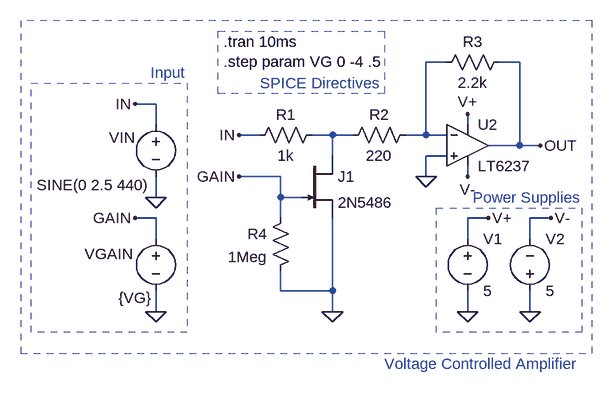
[diagram p0: schematic vca study.asc]
vca study.asc, the LTspice schematic file:
Version 4
SHEET 1 1572 680
WIRE 1168 -48 1136 -48
WIRE 1280 -48 1248 -48
WIRE 720 16 688 16
WIRE 720 48 720 16
WIRE 1200 48 1200 32
WIRE 880 64 848 64
WIRE 992 64 960 64
WIRE 1024 64 992 64
WIRE 1136 64 1136 -48
WIRE 1136 64 1104 64
WIRE 1168 64 1136 64
WIRE 1280 80 1280 -48
WIRE 1280 80 1232 80
WIRE 1312 80 1280 80
WIRE 992 96 992 64
WIRE 1168 96 1136 96
WIRE 912 128 848 128
WIRE 1136 128 1136 96
WIRE 1200 128 1200 112
WIRE 720 160 720 128
WIRE 912 160 912 128
WIRE 944 160 912 160
WIRE 720 192 688 192
WIRE 912 192 912 160
WIRE 1232 192 1200 192
WIRE 1328 192 1296 192
WIRE 720 224 720 192
WIRE 1200 224 1200 192
WIRE 1296 224 1296 192
WIRE 912 304 912 272
WIRE 992 304 992 192
WIRE 992 304 912 304
WIRE 720 336 720 304
WIRE 992 336 992 304
WIRE 1200 336 1200 304
WIRE 1296 336 1296 304
FLAG 1200 32 V+
FLAG 1200 128 V-
FLAG 992 336 0
FLAG 1232 192 V+
FLAG 1200 336 0
FLAG 1328 192 V-
FLAG 1296 336 0
FLAG 720 160 0
FLAG 688 16 IN
FLAG 688 192 GAIN
FLAG 720 336 0
FLAG 848 128 GAIN
FLAG 1136 128 0
FLAG 848 64 IN
FLAG 1312 80 OUT
SYMBOL res 1264 -64 R90
WINDOW 0 0 56 VBottom 2
WINDOW 3 32 56 VTop 2
SYMATTR InstName R3
SYMATTR Value 2.2k
SYMBOL res 1120 48 R90
WINDOW 0 0 56 VBottom 2
WINDOW 3 32 56 VTop 2
SYMATTR InstName R2
SYMATTR Value 220
SYMBOL res 928 176 M0
SYMATTR InstName R4
SYMATTR Value 1Meg
SYMBOL Opamps\\LT6237 1200 80 R0
SYMATTR InstName U2
SYMBOL res 976 48 R90
WINDOW 0 0 56 VBottom 2
WINDOW 3 32 56 VTop 2
SYMATTR InstName R1
SYMATTR Value 1k
SYMBOL njf 944 96 R0
SYMATTR InstName J1
SYMATTR Value 2N5486
SYMBOL voltage 1200 208 R0
WINDOW 123 0 0 Left 2
WINDOW 39 0 0 Left 2
SYMATTR InstName V1
SYMATTR Value 5
SYMBOL voltage 1296 320 M180
WINDOW 0 24 96 Left 2
WINDOW 3 24 16 Left 2
SYMATTR InstName V2
SYMATTR Value 5
SYMBOL voltage 720 32 M0
WINDOW 3 10 109 Left 2
WINDOW 123 0 0 Left 2
WINDOW 39 0 0 Left 2
WINDOW 0 32 36 Left 2
SYMATTR Value SINE(0 2.5 440)
SYMATTR InstName VIN
SYMBOL voltage 720 208 M0
WINDOW 3 6 107 Left 2
WINDOW 123 0 0 Left 2
WINDOW 39 0 0 Left 2
WINDOW 0 35 39 Left 2
SYMATTR Value {VG}
SYMATTR InstName VGAIN
TEXT 824 -80 Left 2 !.tran 10ms\n.step param VG 0 -4 .5
TEXT 1208 160 Left 2 ;Power Supplies
TEXT 712 -32 Left 2 ;Input
TEXT 880 -16 Left 2 ;SPICE Directives
TEXT 1072 416 Left 2 ;Voltage Controlled Amplifier
RECTANGLE Normal 1376 368 1152 176 2
RECTANGLE Normal 528 -16 768 368 2
RECTANGLE Normal 1072 0 816 -96 2
RECTANGLE Normal 1392 -112 512 400 2

The netlist it stands for:
* vca study.asc
R3 OUT N001 2.2k
R2 N001 N002 220
R4 GAIN 0 1Meg
* U2: LT6237 (symbol Opamps\LT6237 not available, pins judged from their places): In+=0 In-=N001 V+=V+ V-=V- OUT=OUT
R1 N002 IN 1k
J1 N002 GAIN 0 2N5486
V1 V+ 0 5
V2 0 V- 5
VIN IN 0 SINE(0 2.5 440)
VGAIN GAIN 0 {VG}
.model NJF NJF
.model PJF PJF
.lib standard.jft
.tran 10ms
.step param VG 0 -4 .5
* Power Supplies
* Input
* SPICE Directives
* Voltage Controlled Amplifier
.backanno
.end